# EAGLE schematic Data Logger 1 (EAGLE 9.6.2)
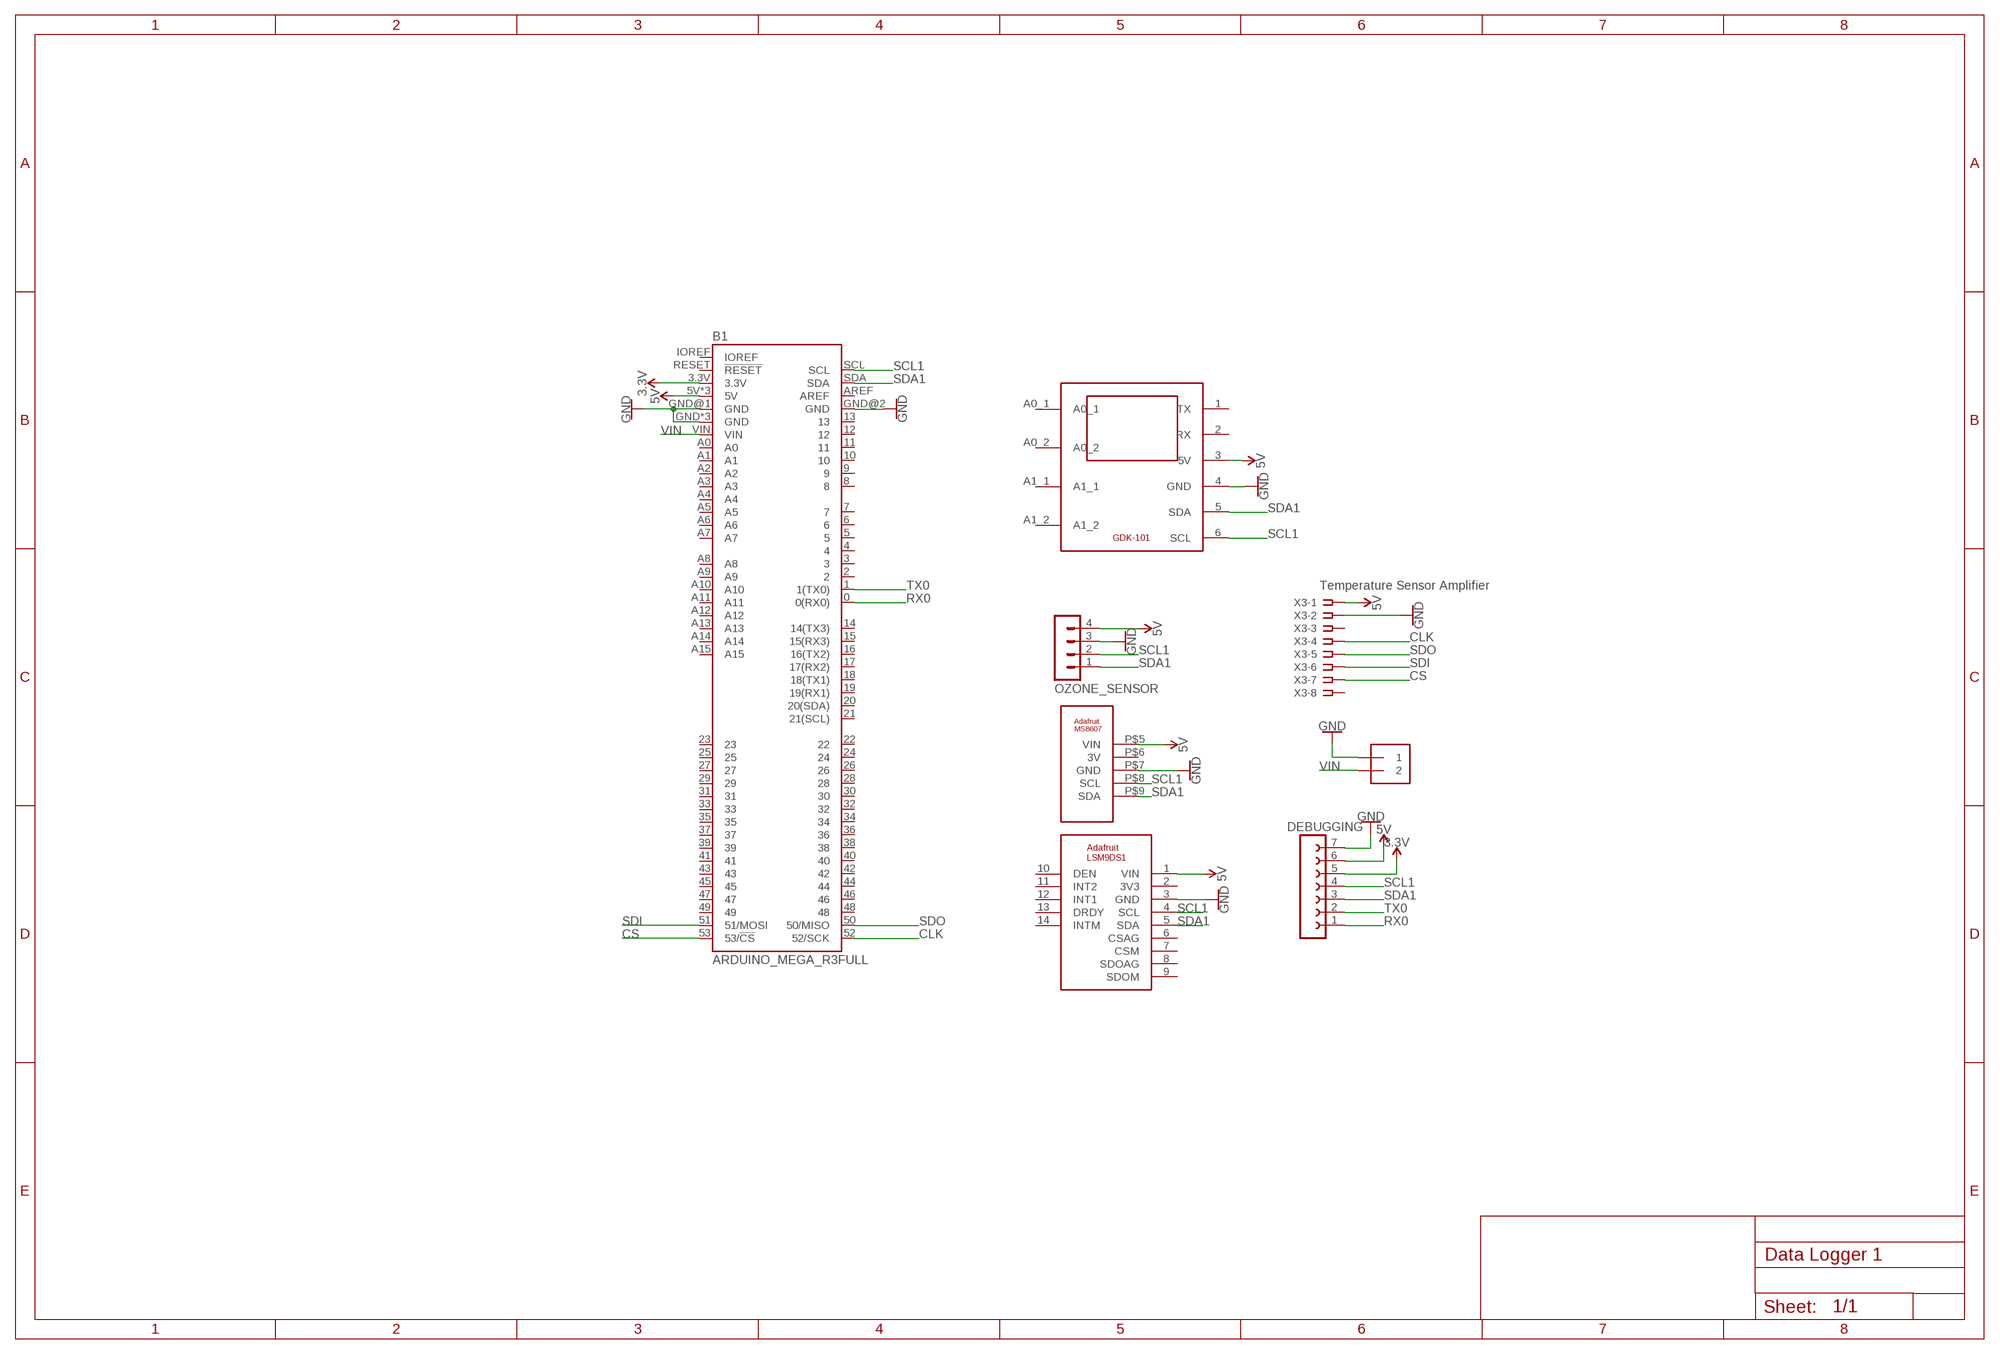
[diagram p0: schematic, sheet 1]

## Parts
B1  ARDUINO_MEGA_R3FULL  [ARDUINO_MEGA_NO_SILK]
DEBUGGING  FE07-1  [FE07]
OZONE_SENSOR  OZONE_SENSOR  MA04-1  [MA04-1]
POWER_7-12V  1X2-3.5MM  [1X2-3.5MM]
PRESSURE_SENSOR  ADAFRUIT_MS8607  [ADAFRUIT_MS8607]
U$1  FTLAB_GAMMA_SENSOR_MODULETHROUGH_HOLE  [FTLAB_GAMMA_SENSOR_MODULE]
U$2  ADAFRUIT_LSM9DS1  [ADAFRUIT_LSM9DS1]
X3  Temperature Sensor Amplifier  SSW-108-02-G-S  [SSW-108-02-G-S]

## Nets
3.3V: B1.3.3V DEBUGGING.5
5V: B1.5V B1.5V@1(5V) B1.5V@2(5V) DEBUGGING.6 OZONE_SENSOR.4 PRESSURE_SENSOR.P$5(VIN) U$1.3(5V) U$2.1(VIN) X3.1
CLK: B1.52(52/SCK) X3.4
CS: B1.53(53/!CS) X3.7
GND: B1.GND B1.GND@1(GND) B1.GND@2(GND) B1.GND@3(GND) B1.GND@4(GND) DEBUGGING.7 OZONE_SENSOR.3 POWER_7-12V.1 PRESSURE_SENSOR.P$7(GND) U$1.4(GND) U$2.3(GND) X3.2
RX0: B1.0(0(RX0)) DEBUGGING.1
SCL1: B1.SCL DEBUGGING.4 OZONE_SENSOR.2 PRESSURE_SENSOR.P$8(SCL) U$1.6(SCL) U$2.4(SCL)
SDA1: B1.SDA DEBUGGING.3 OZONE_SENSOR.1 PRESSURE_SENSOR.P$9(SDA) U$1.5(SDA) U$2.5(SDA)
SDI: B1.51(51/MOSI) X3.6
SDO: B1.50(50/MISO) X3.5
TX0: B1.1(1(TX0)) DEBUGGING.2
VIN: B1.VIN POWER_7-12V.2
Unconnected: B1.2 B1.3 B1.4 B1.5 B1.6 B1.7 B1.8 B1.9 B1.10 B1.11 B1.12 B1.13 B1.14(14(TX3)) B1.15(15(RX3)) B1.16(16(TX2)) B1.17(17(RX2)) B1.18(18(TX1)) B1.19(19(RX1)) B1.20(20(SDA)) B1.21(21(SCL)) B1.22 B1.23 B1.24 B1.25 B1.26 B1.27 B1.28 B1.29 B1.30 B1.31 B1.32 B1.33 B1.34 B1.35 B1.36 B1.37 B1.38 B1.39 B1.40 B1.41 B1.42 B1.43 B1.44 B1.45 B1.46 B1.47 B1.48 B1.49 B1.A0 B1.A1 B1.A2 B1.A3 B1.A4 B1.A5 B1.A6 B1.A7 B1.A8 B1.A9 B1.A10 B1.A11 B1.A12 B1.A13 B1.A14 B1.A15 B1.AREF B1.IOREF B1.RESET(!RESET) PRESSURE_SENSOR.P$6(3V) U$1.1(TX) U$1.2(RX) U$1.A0_1 U$1.A0_2 U$1.A1_1 U$1.A1_2 U$2.2(3V3) U$2.6(CSAG) U$2.7(CSM) U$2.8(SDOAG) U$2.9(SDOM) U$2.10(DEN) U$2.11(INT2) U$2.12(INT1) U$2.13(DRDY) U$2.14(INTM) X3.3 X3.8

## Library data of the parts
B1 = SparkFun-Boards:ARDUINO_MEGA_R3: Arduino Mega R3 ATmega2560 R3 compatible footprint. SparkFun Products: Arduino Mega 2560 R3 <https://www.sparkfun.com/products/11061>
DEBUGGING = con-lsta:FE07-1: FEMALE HEADER; OC_FARNELL: unknown; OC_NEWARK: unknown
OZONE_SENSOR = con-lstb:MA04-1: PIN HEADER; OC_FARNELL: unknown; OC_NEWARK: unknown
POWER_7-12V = adafruit:1X2: 3.5mm Terminal block http://www.ladyada.net/library/pcb/eaglelibrary.html
PRESSURE_SENSOR = Adafruit MS8607:ADAFRUIT_MS8607
U$1 = FTLAB-Gamma-Sensor-Module:FTLAB_GAMMA_SENSOR_MODULE
U$2 = Adafruit LSM9DS1:ADAFRUIT_LSM9DS1
X3 = con-samtec:SSW-108-02-G-S: THROUGH-HOLE .025" SQ POST SOCKET Source: Samtec SSW.pdf; MF: Samtec Inc.; MPN: SSW-108-02-G-S; OC_FARNELL: unknown; OC_NEWARK: 11P9448